# Altium schematic sheet LED_Module.SchDoc
size A; SheetNumber: 4; SheetTotal: 5
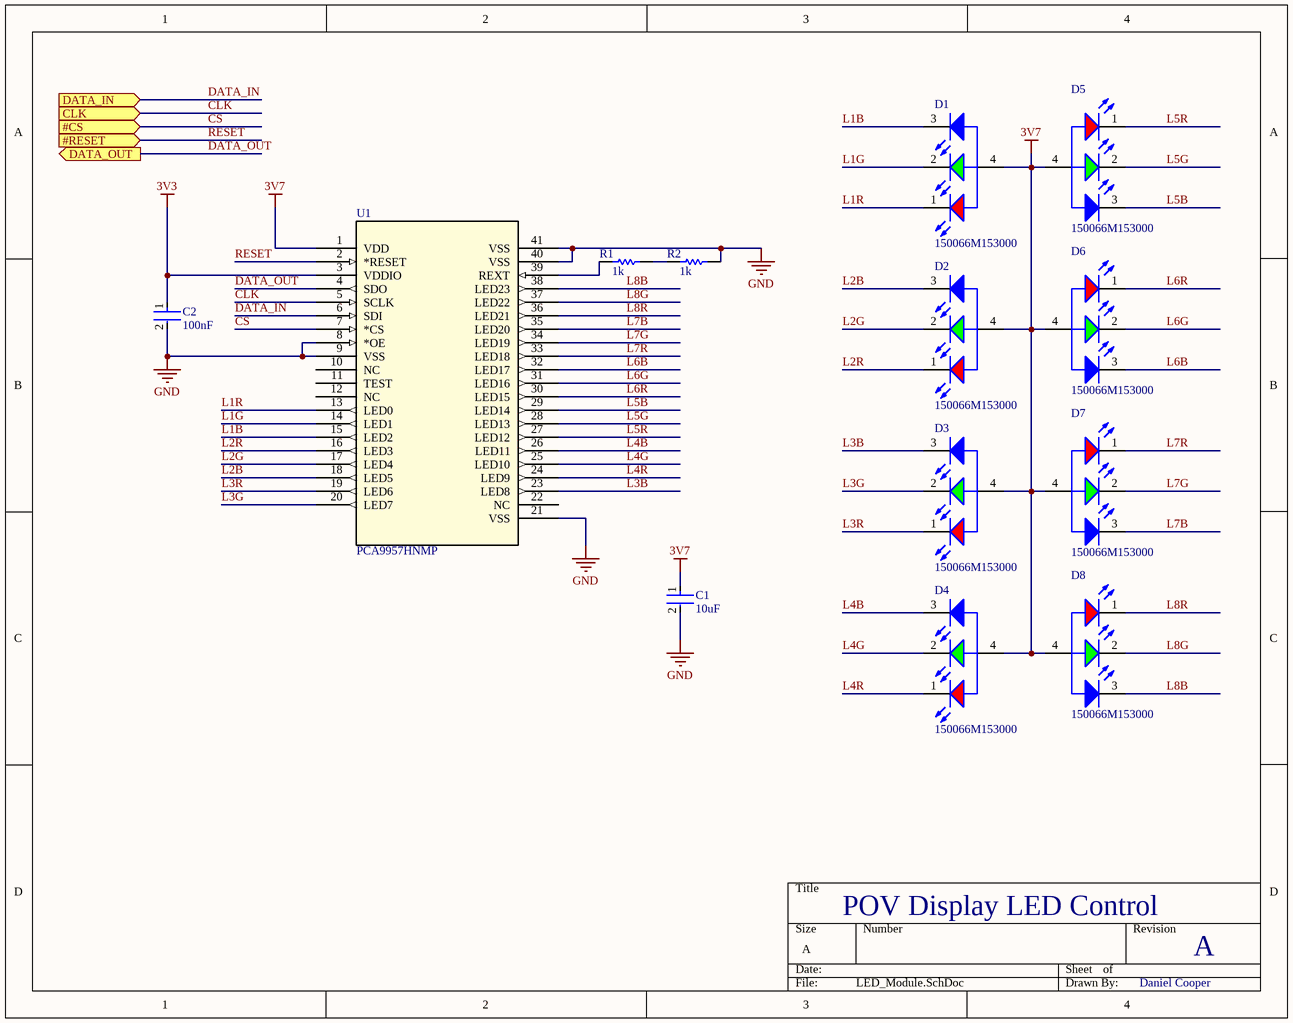
[diagram p0: LED_Module.SchDoc]

## Parts
C1  10uF  [FP-CL21-IPC_B]
C2  100nF  [FP-CL21-IPC_C]
D1  150066M153000  [WL-SFCD_0606]
D2  150066M153000  [WL-SFCD_0606]
D3  150066M153000  [WL-SFCD_0606]
D4  150066M153000  [WL-SFCD_0606]
D5  150066M153000  [WL-SFCD_0606]
D6  150066M153000  [WL-SFCD_0606]
D7  150066M153000  [WL-SFCD_0606]
D8  150066M153000  [WL-SFCD_0606]
R1  1k  [RESC2013X60X35ML10T20]
R2  1k  [RESC2013X60X35ML10T20]
U1  PCA9957HNMP  [HVQFN40_SOT1369-5_NXP]

## Ports
#CS (in), #RESET (in), CLK (in), DATA_IN (in), DATA_OUT (out)

## Nets
3V3: C2.1 U1.3(VDDIO)
3V7: C1.1 D1.4(A) D2.4(A) D3.4(A) D4.4(A) D5.4(A) D6.4(A) D7.4(A) D8.4(A) U1.1(VDD)
GND: C1.2 C2.2 R2.2 U1.8(*OE) U1.9(VSS) U1.21(VSS) U1.40(VSS) U1.41(VSS)
CLK: U1.5(SCLK) ; port CLK
CS: U1.7(*CS) ; port #CS
DATA_IN: U1.6(SDI) ; port DATA_IN
DATA_OUT: U1.4(SDO) ; port DATA_OUT
L1B: D1.3(K) U1.15(LED2)
L1G: D1.2(K) U1.14(LED1)
L1R: D1.1(K) U1.13(LED0)
L2B: D2.3(K) U1.18(LED5)
L2G: D2.2(K) U1.17(LED4)
L2R: D2.1(K) U1.16(LED3)
L3B: D3.3(K) U1.23(LED8)
L3G: D3.2(K) U1.20(LED7)
L3R: D3.1(K) U1.19(LED6)
L4B: D4.3(K) U1.26(LED11)
L4G: D4.2(K) U1.25(LED10)
L4R: D4.1(K) U1.24(LED9)
L5B: D5.3(K) U1.29(LED14)
L5G: D5.2(K) U1.28(LED13)
L5R: D5.1(K) U1.27(LED12)
L6B: D6.3(K) U1.32(LED17)
L6G: D6.2(K) U1.31(LED16)
L6R: D6.1(K) U1.30(LED15)
L7B: D7.3(K) U1.35(LED20)
L7G: D7.2(K) U1.34(LED19)
L7R: D7.1(K) U1.33(LED18)
L8B: D8.3(K) U1.38(LED23)
L8G: D8.2(K) U1.37(LED22)
L8R: D8.1(K) U1.36(LED21)
RESET: U1.2(*RESET) ; port #RESET
NetR1_1: R1.1 U1.39(REXT)
NetR1_2: R1.2 R2.1

Not connected (* = marked no-connect by the designer): U1 10(NC) 11(TEST) 12(NC) 22(NC)

## Notes on the sheet
- POV Display LED Control
- A
- Daniel Cooper

## Library data of the parts
C1 = CMP-2000-06102-2: CL21 Series 0805 10uF 16V ±10% Tolerance X5R Multilayer Ceramic Chip Capacitor; Dielectric: X7R; Length: 2mm; Depth: 1.25mm; Voltage: 16V; Width: 0.049inch; Capacitance: 10uF; Lead Free: Lead Free; Max Operating Temperature: 85°C; Mount: Surface Mount; Voltage Rating: 16V; Height: 1.25mm; Radiation Hardening: No; Packaging: Tape and Reel; Voltage Rating (DC): 16V; Thickness: 0.055inch; Case/Package: 0805; Case Code (Imperial): 0805; Min Operating Temperature: -55°C; Case Code (Metric): 2012; Package Quantity: 1; Tolerance: 10%
C2 = CMP-2000-05017-2: CL21 Series 0805 100nF 50V ±10% Tolerance X7R Multilayer Ceramic Chip Capacitor; Depth: 1.25mm; Height: 0.85mm; Width: 0.049inch; Tolerance: 10%; Case Code (Metric): 2012; Case Code (Imperial): 0805; Material: Ceramic; Thickness: 0.037inch; Min Operating Temperature: -55°C; Contact Plating: Tin; Length: 2mm; Mount: Surface Mount; Voltage Rating (DC): 50V; Lead Free: Lead Free; Dielectric: X7R; Radiation Hardening: No; Capacitance: 100nF; Voltage Rating: 50V; Case/Package: 0805; Packaging: Tape and Reel; Max Operating Temperature: 125°C; Voltage: 50V
D1-D8 = CMP-207942-000005-2: LED RGB DIFFUSED SMD; NexarPartId: 82270972; Peak Wavelength: 468nm; Reverse Voltage: 5V; Power Dissipation: 48mW; Forward Current: 40mA; Forward Voltage: 2V; Color: Blue, Green, Red; Viewing Angle: 120°; Dominant Wavelength: 525nm; Luminous Intensity: 180mcd; RoHS: Compliant; Width: 1.6mm; Min Operating Temperature: -40°C; Packaging: Tape and Reel; Max Operating Temperature: 85°C; Max Reverse Voltage (DC): 5V; Length: 1.6mm; Height: 400µm
R1 R2 = CMP-2100-03671-1: Chip Resistor, 1 KOhm, +/- 1%, 125 mW, -55 to 155 degC, 0805 (2012 Metric), RoHS, Tape and Reel; Manufacturer: Yageo; Temperature Coefficient: 100ppm/degreesC; Voltage Rating (DC): 150V; Max Power Dissipation: 125mW; Resistance: 1KOhm; Number of Pins: 2; Number of Terminations: 2; Datasheet URL: http://www.yageo.com/NewPortal/yageodocoutput?fileName=/pdf/R-Chip/PYu-RC_Group_51_RoHS_L_5.pdf; Length: 0.079inch; Package Description: 2-Pin Surface Mounted Device, Body 2 x 1.25 mm; Depth: 1.25mm; Height: 0.024inch; Military Standard: Not; Case/Package: 0805; Package Reference: 0805; RoHSCompliant: true; Lead Free: LeadFree; Packaging: TapeandReel; Package Quantity: 1; Datasheet Version: Rev. 5, 10/2016; Tolerance: 1%; Min Operating Temperature: -55degC; Voltage Rating: 150V; Composition: ThickFilm; Case Code (Imperial): 0805; Power Rating: 125mW; Width: 0.049inch; Case Code (Metric): 2012; Manufacturer URL: http://www.yageo.com/; Max Operating Temperature: 155degC; REACH SVHC: Unknown; Termination: SMD/SMT
U1 = PCA9957HNMP: No Description Available; Mfr_Name: NXP; RefDes: RefDes; Type: Type